# Altium schematic sheet KS-WL-GW-ETH.SchDoc
size A4; CheckedBy: Fan mingjie; DrawnBy: Jason Huang; Address1: Buliding 5, No.1528; Address2: Gu Mei Rd HQ6; Address3: Shanghai, China; Address4: 20233; DocumentNumber: 1; Revision: 1; SheetNumber: 1; SheetTotal: 2
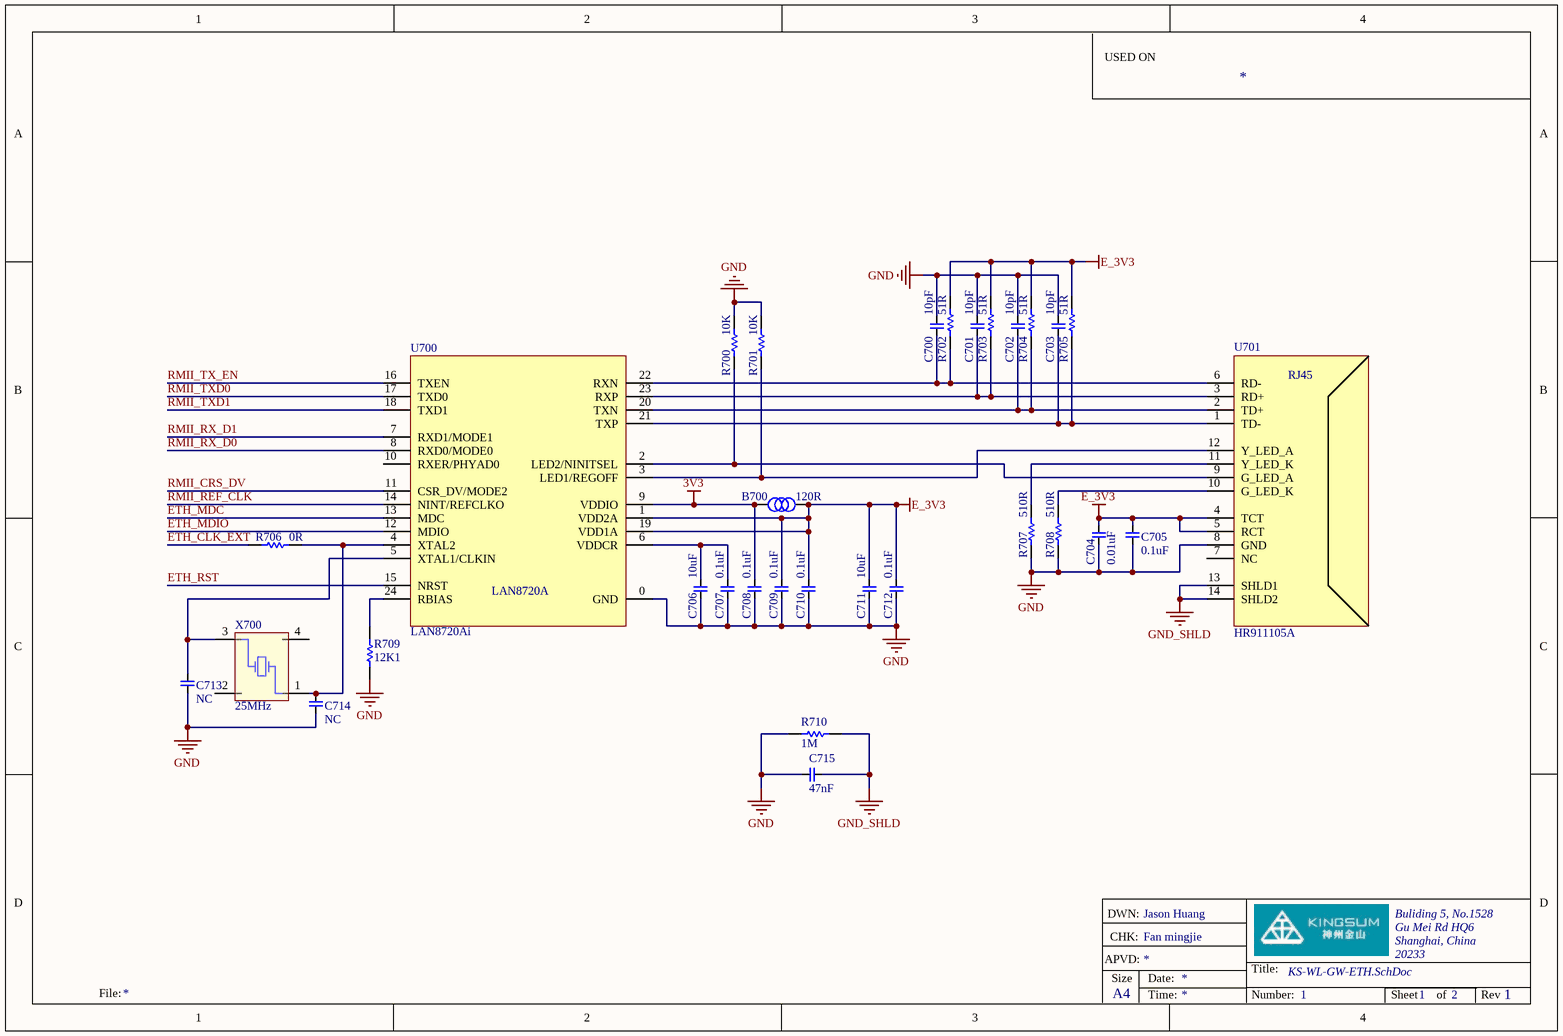
[diagram p0: KS-WL-GW-ETH.SchDoc]

## Parts
B700  120R  [0603 RES]
C700  10pF  [0402 CAP]
C701  10pF  [0402 CAP]
C702  10pF  [0402 CAP]
C703  10pF  [0402 CAP]
C704  0.01uF  [0402 CAP]
C705  0.1uF  [0402 CAP]
C706  10uF  [C0805]
C707  0.1uF  [0402 CAP]
C708  0.1uF  [0402 CAP]
C709  0.1uF  [0402 CAP]
C710  0.1uF  [0402 CAP]
C711  10uF  [C0805]
C712  0.1uF  [0402 CAP]
C713  NC  [0402 CAP]
C714  NC  [0402 CAP]
C715  47nF  [C1206]
R700  10K  [0402 Res]
R701  10K  [0402 Res]
R702  51R  [0402 Res]
R703  51R  [0402 Res]
R704  51R  [0402 Res]
R705  51R  [0402 Res]
R706  0R  [0402 Res]
R707  510R  [0402 Res]
R708  510R  [0402 Res]
R709  12K1  [0402 Res]
R710  1M  [0402 Res]
U700  LAN8720Ai  [QFN24 4X4 0.5]
U701  HR911105A  [RJ45 Socket]
X700  25MHz  [XTAL_4 - 25X20]

## Nets
3V3: B700.1 C708.2 U700.9(VDDIO)
E_3V3: B700.2 C704.2 C705.2 C709.2 C710.2 C711.2 C712.2 R702.2 R703.2 R704.2 R705.2 U700.1(VDD2A) U700.19(VDD1A) U701.4(TCT) U701.5(RCT)
GND: C700.2 C701.2 C702.2 C703.2 C704.1 C705.1 C706.1 C707.1 C708.1 C709.1 C710.1 C711.1 C712.1 C713.1 C714.1 C715.1 R700.2 R701.2 R707.1 R708.1 R709.1 R710.2 U700.0(GND) U701.8(GND)
GND_SHLD: C715.2 R710.1 U701.13(SHLD1) U701.14(SHLD2)
ETH_CLK_EXT: R706.1
ETH_MDC: U700.13(MDC)
ETH_MDIO: U700.12(MDIO)
ETH_RST: U700.15(NRST)
RMII_CRS_DV: U700.11(CSR_DV/MODE2)
RMII_REF_CLK: U700.14(NINT/REFCLKO)
RMII_RX_D0: U700.8(RXD0/MODE0)
RMII_RX_D1: U700.7(RXD1/MODE1)
RMII_TX_EN: U700.16(TXEN)
RMII_TXD0: U700.17(TXD0)
RMII_TXD1: U700.18(TXD1)
NetC700_1: C700.1 R702.1 U700.22(RXN) U701.6(RD-)
NetC701_1: C701.1 R703.1 U700.23(RXP) U701.3(RD+)
NetC702_1: C702.1 R704.1 U700.20(TXN) U701.2(TD+)
NetC703_1: C703.1 R705.1 U700.21(TXP) U701.1(TD-)
NetC706_2: C706.2 C707.2 U700.6(VDDCR)
NetC713_2: C713.2 U700.5(XTAL1/CLKIN) X700.3(OSC3)
NetC714_2: C714.2 R706.2 U700.4(XTAL2) X700.1(OSC1)
NetR700_1: R700.1 U700.2(LED2/NINITSEL) U701.9(G_LED_A)
NetR701_1: R701.1 U700.3(LED1/REGOFF) U701.12(Y_LED_A)
NetR707_2: R707.2 U701.11(Y_LED_K)
NetR708_2: R708.2 U701.10(G_LED_K)
NetR709_2: R709.2 U700.24(RBIAS)

Not connected (* = marked no-connect by the designer): U700 10(RXER/PHYAD0); U701 7(NC); X700 2(OSC2) 4(OSC4)

## Notes on the sheet
- USED ON
- DWN:
- APVD:
- CHK:
- Size
- Date:
- Title:
- File:
- A4
- Time:
- Number:
- Sheet
- of
- Rev
- (in symbol Kingsum-LAN-LAN8720Ai) LAN8720A
- (in symbol Kingsum-Socket-RJ45) RJ45

## Library data of the parts
B700 = ADE-Bead-BLM18PG121SN1D: Bead, Power, 1000mA, CHIP, SURFACE MOUNT , 120R; Part Rev: J; Part Description: Bead, Power, 1000mA, CHIP, SURFACE MOUNT,120R, 0.05R; Manufacturer: MURATA; Precision: +/-20%; DC Resistance (DCR): 0.05R; Shielding: NO; Current Rating: 2000mA; Option: 0; TE PN: ADE-Bead-BLM18PG121SN1D; Series: Bead; RoHS Compliant: NO; Value: 120R; Package: 0603; Footprint: 0603; SPICE model: Bead; Signal Integrity: Bead; Published: 10/14/2016; Publisher: TE Connectivity; LatestRevisionDate: 1/11/2012; LatestRevisionNote: PRODUCTION; ComponentLink1Description: Datasheet; ComponentLink1URL: http://cn.element14.com/jsp/search/productdetail.jsp?sku=1515745&CMP=KNC-BAI-SEPO-SKU-MUR&mckv=1af2yi9PU|pcrid|1462500496; ComponentLink2Description: Web Page; ComponentLink2URL: http://cn.element14.com/jsp/search/productdetail.jsp?sku=1515745&CMP=KNC-BAI-SEPO-SKU-MUR&mckv=1af2yi9PU|pcrid|1462500496; Mfr_PN: BLM18PG121SN1D; ComponentLink3Description: Package; ComponentLink3URL: http://cn.element14.com/jsp/search/productdetail.jsp?sku=1515745&CMP=KNC-BAI-SEPO-SKU-MUR&mckv=1af2yi9PU|pcrid|1462500496; Price: *
C700-C703 = ADE-C0402-10P: Non-polarised capacitor; Part Rev: V; Part Description: CAPACITOR, CERAMIC CHIP, 0402 CASE, SURFACE MOUNT , 10 pF +/-5% 50 V, C0G; Mfr_PN: GRM1555C1H100JA01; Manufacturer: MURATA; Tolerance: +/-5%; Volt-Rated: 50 V; Signal Integrity: Cap; Option: 0; TE PN: ADE-C0402-10P; Series: MLCC; RoHS Compliant: YES; Value: 10pF; Package: 0402; Footprint: 0402; SPICE model: CAP; Published: 10/14/2016; Publisher: TE Connectivity; LatestRevisionDate: 04/22/2013; LatestRevisionNote: Production; ComponentLink1Description: Datasheet; ComponentLink1URL: http://engineeringportal.tycoelectronics.com/web/engineering/part-inquiry?PartNo=1-20065-7; ComponentLink3Description: Package; ComponentLink3URL: http://www.murata.com/products/catalog/pdf/c02e.pdf; ComponentLink2Description: Web Page; ComponentLink2URL: http://dmtec.tycoelectronics.com/dmtec/servlet/DocumentLookup?type=Production+Drawing&name=20065&format=PDF; Price: *; Stock: *; Stock Position: *
C704 = ADE-C0402-0.01U: Non-polarised capacitor; Part Rev: V; Part Description: CAPACITOR, CERAMIC CHIP, 0402 CASE, SURFACE MOUNT , 0.01 uF +/-10% 50 V, X7R; Mfr_PN: GRM155R71H103KA88; Manufacturer: MURATA; Tolerance: +/-10%; Volt-Rated: 50 V; Signal Integrity: Cap; Option: 0; TE PN: ADE-C0402-0.01U; Series: MLCC; RoHS Compliant: YES; Value: 0.01uF; Package: 0402; Footprint: 0402; SPICE model: CAP; Published: 10/14/2016; Publisher: TE Connectivity; LatestRevisionDate: 04/22/2013; LatestRevisionNote: Production; ComponentLink1Description: Datasheet; ComponentLink1URL: http://engineeringportal.tycoelectronics.com/web/engineering/part-inquiry?PartNo=1-20065-7; ComponentLink3Description: Package; ComponentLink3URL: http://www.murata.com/products/catalog/pdf/c02e.pdf; ComponentLink2Description: Web Page; ComponentLink2URL: http://dmtec.tycoelectronics.com/dmtec/servlet/DocumentLookup?type=Production+Drawing&name=20065&format=PDF
C705 C707-C710 C712 = ADE-C0402-0.1U: Non-polarised capacitor; Part Rev: V; Part Description: CAPACITOR, CERAMIC CHIP, 0402 CASE, SURFACE MOUNT , 0.1 uF +/-20% 25 V, X7R; Mfr_PN: GRM155R61E104KA87; Manufacturer: MURATA; Tolerance: +/-10%; Volt-Rated: 25 V; Signal Integrity: Cap; Option: 0; TE PN: ADE-C0402-0.1U; Series: MLCC; RoHS Compliant: YES; Value: 0.1uF; Package: 0402; Footprint: 0402; SPICE model: CAP; Published: 10/14/2016; Publisher: TE Connectivity; LatestRevisionDate: 04/22/2013; LatestRevisionNote: Production; ComponentLink1Description: Datasheet; ComponentLink1URL: http://engineeringportal.tycoelectronics.com/web/engineering/part-inquiry?PartNo=1-20065-7; ComponentLink3Description: Package; ComponentLink3URL: http://www.murata.com/products/catalog/pdf/c02e.pdf; ComponentLink2Description: Web Page; ComponentLink2URL: http://dmtec.tycoelectronics.com/dmtec/servlet/DocumentLookup?type=Production+Drawing&name=20065&format=PDF; Manufacturer2: Yageo; Mfr_PN2: CC0402KRX7R8BB104
C706 C711 = ADE-C0805-10U: Non-polarised capacitor; Part Rev: V; Part Description: CAPACITOR, CERAMIC CHIP, 0805 CASE, SURFACE MOUNT , 10 uF +/-10% 25 V, X5R; Mfr_PN: GRM219R61E475KA73; Manufacturer: MURATA; Tolerance: +/-10%; Volt-Rated: 25 V; Signal Integrity: Cap; Option: 0; TE PN: ADE-C0805-10U; Series: MLCC; RoHS Compliant: YES; Value: 10uF; Package: C0805; SPICE model: CAP; Published: 10/17/2016; Publisher: TE Connectivity; LatestRevisionDate: 04/22/2013; LatestRevisionNote: Production; ComponentLink1Description: Datasheet; ComponentLink1URL: http://engineeringportal.tycoelectronics.com/web/engineering/part-inquiry?PartNo=1-20065-7; ComponentLink3Description: Package; ComponentLink3URL: http://www.murata.com/products/catalog/pdf/c02e.pdf; ComponentLink2Description: Web Page; ComponentLink2URL: http://dmtec.tycoelectronics.com/dmtec/servlet/DocumentLookup?type=Production+Drawing&name=20065&format=PDF; Price: *; Stock: *; Stock Position: *
C713 C714 = ADE-C0402-NC: Non-polarised capacitor; Part Rev: V; Part Description: CAPACITOR, CERAMIC CHIP, 0402 CASE, SURFACE MOUNT ,NC; Manufacturer: MURATA; Signal Integrity: Cap; Option: 0; TE PN: ADE-C0402-NC; Series: MLCC; RoHS Compliant: YES; Value: NC; Tolerance: -; Package: 0402; Volt-Rated: -; Footprint: 0402; SPICE model: CAP; Published: 10/14/2016; Publisher: TE Connectivity; LatestRevisionDate: 11/29/2012; LatestRevisionNote: Production; ComponentLink1Description: Datasheet; ComponentLink1URL: http://engineeringportal.tycoelectronics.com/web/engineering/part-inquiry?PartNo=1-20065-7; Mfr_PN: NC; ComponentLink3Description: Package; ComponentLink3URL: http://www.murata.com/products/catalog/pdf/c02e.pdf; ComponentLink2Description: Web Page; ComponentLink2URL: http://dmtec.tycoelectronics.com/dmtec/servlet/DocumentLookup?type=Production+Drawing&name=20065&format=PDF
C715 = ADE-C1206-47nF: Non-polarised capacitor; Part Rev: V; Part Description: CAPACITOR, CERAMIC CHIP, 1206 CASE, SURFACE MOUNT , 47 nF +/-5% 50 V, C0G; Mfr_PN: GRM31M5C1H473JA01#; Manufacturer: MURATA; TE PN: ADE-C1206-47U; Tolerance: +/-5%; Volt-Rated: 50V; Signal Integrity: Cap; Option: 0; Series: MLCC; RoHS Compliant: YES; Value: 47nF; Package: C1206; SPICE model: CAP; Published: 10/17/2016; Publisher: TE Connectivity; LatestRevisionDate: 23/01/2015; LatestRevisionNote: Production; ComponentLink1Description: Datasheet; ComponentLink1URL: http://engineeringportal.tycoelectronics.com/web/engineering/part-inquiry?PartNo=1-20065-7; ComponentLink3Description: Package; ComponentLink3URL: http://www.murata.com/products/catalog/pdf/c02e.pdf; ComponentLink2Description: Web Page; ComponentLink2URL: http://dmtec.tycoelectronics.com/dmtec/servlet/DocumentLookup?type=Production+Drawing&name=20065&format=PDF
R700 R701 = ADE-R0402-10K: RESISTOR  Normal; Part Rev: A; Part Description: RESISTOR, CHIP, THICK FILM, SURGE CURRENT, 0402 CASE, 1/16 W, 50 V , 10K OHMS +/-5%, +/-100 PPM/DEG C, TIN TERMINATION; Mfr_PN: RC0402JR-7D10KL; Manufacturer: YAGEO; Precision: +/-5%; Volt-Rated: 50 V; Power-Rated: 1/16 W; Signal Integrity: Res; Option: 0; TE_PN: ADE-R0402-10K; ComponentLink2Description: Web Page; ComponentLink2URL: http://dmtec.tycoelectronics.com/dmtec/servlet/DocumentLookup?type=Production+Drawing&name=1900457&format=PDF; Series: General Purpose Chip Resistors; ComponentLink3URL: http://www.yageo.com/documents/recent/PYu-RC0402_51_RoHS_L_6_r.pdf; RoHS Compliant: YES; Value: 10K; Package: 0402; Footprint: kOA1E-0402; SPICE model: RESISTOR; Published: 25/04/2013; Publisher: TE Connectivity; LatestRevisionDate: 25/04/2013; LatestRevisionNote: Production; ComponentLink1URL: http://engineeringportal.tycoelectronics.com/web/engineering/part-inquiry?PartNo=1900457-1; ComponentLink1Description: Datasheet; ComponentLink3Description: Package
R702-R705 = ADE-R0402-51R: RESISTOR  Normal; Part Rev: A; Part Description: RESISTOR, CHIP, THICK FILM, SURGE CURRENT, 0402 CASE, 1/16 W, 50 V , 51 OHMS +/-5%, +/-100 PPM/DEG C, TIN TERMINATION; Mfr_PN: RC0402JR-7D51RL; Manufacturer: YAGEO; Precision: +/-5%; Volt-Rated: 50 V; Power-Rated: 1/16 W; Signal Integrity: Res; Option: 0; TE_PN: ADE-R0402-51R; ComponentLink2Description: Web Page; ComponentLink2URL: http://dmtec.tycoelectronics.com/dmtec/servlet/DocumentLookup?type=Production+Drawing&name=1900457&format=PDF; Series: General Purpose Chip Resistors; ComponentLink3URL: http://www.yageo.com/documents/recent/PYu-RC0402_51_RoHS_L_6_r.pdf; RoHS Compliant: YES; Value: 51R; Package: 0402; Footprint: kOA1E-0402; SPICE model: RESISTOR; Published: 25/04/2013; Publisher: TE Connectivity; LatestRevisionDate: 04/25/2013; LatestRevisionNote: Production; ComponentLink1URL: http://engineeringportal.tycoelectronics.com/web/engineering/part-inquiry?PartNo=1900457-1; ComponentLink1Description: Datasheet; ComponentLink3Description: Package
R706 = ADE-R0402-0R: RESISTOR  Normal; Part Rev: A; Part Description: RESISTOR, CHIP, THICK FILM, SURGE CURRENT, 0402 CASE, 1/16 W, 50V, 1 A , 0 OHMS +/-5%, +/-200 PPM/DEG C, TIN TERMINATION; Mfr_PN: RC0402JR-7D0RL; Manufacturer: YAGEO; Precision: +/-5%; Volt-Rated: 50 V; Power-Rated: 1/16 W; Signal Integrity: Res; Option: 0; TE_PN: ADE-R0402-0R; ComponentLink2Description: Web Page; ComponentLink2URL: http://dmtec.tycoelectronics.com/dmtec/servlet/DocumentLookup?type=Production+Drawing&name=1900457&format=PDF; Series: General Purpose Chip Resistors; ComponentLink3URL: http://www.yageo.com/documents/recent/PYu-RC0402_51_RoHS_L_6_r.pdf; RoHS Compliant: YES; Value: 0R; Package: 0402; Footprint: kOA1E-0402; SPICE model: RESISTOR; Published: 25/04/2013; Publisher: TE Connectivity; LatestRevisionDate: 11/15/2012; LatestRevisionNote: Production; ComponentLink1URL: http://engineeringportal.tycoelectronics.com/web/engineering/part-inquiry?PartNo=1900457-1; ComponentLink1Description: Datasheet; ComponentLink3Description: Package
R707 R708 = ADE-R0402-510R: RES, Carbon Film SMT0402, 510 Ohm, 5%, 1/16W; Part Rev: A; Mfr_PN: RC0402JR-7D510RL; Manufacturer: YAGEO; Precision: +/-5%; Volt-Rated: 50 V; Option: 0; TE_PN: ADE-R0402-510R; ComponentLink2Description: Web Page; ComponentLink2URL: http://dmtec.tycoelectronics.com/dmtec/servlet/DocumentLookup?type=Production+Drawing&name=1900457&format=PDF; Series: General Purpose Chip Resistors; Part Description: RES, Carbon Film SMT0402, 510 Ohm, 5%, 1/16W; ComponentLink3URL: http://www.yageo.com/documents/recent/PYu-RC0402_51_RoHS_L_6_r.pdf; RoHS Compliant: YES; Value: 510R; Package: 0402; Power-Rated: 1/16 W; Footprint: 0402; SPICE model: RESISTOR; Signal Integrity: Res; Published: 25/04/2013; Publisher: TE Connectivity; LatestRevisionDate: 25/04/2013; LatestRevisionNote: Production; ComponentLink1URL: http://engineeringportal.tycoelectronics.com/web/engineering/part-inquiry?PartNo=1900457-1; ComponentLink1Description: Datasheet; ComponentLink3Description: Package
R709 = ADE-R0402-12K1-1%: RESISTOR  Normal; Part Rev: A; Part Description: RESISTOR, CHIP, THICK FILM, SURGE CURRENT, 0402 CASE, 1/16 W, 50 V , 12K OHMS +/-1%, +/-100 PPM/DEG C, TIN TERMINATION; Mfr_PN: RC0402FR-0712K1L; Manufacturer: YAGEO; Precision: +/-1%; Volt-Rated: 50 V; Power-Rated: 1/16 W; Signal Integrity: Res; Option: 0; ComponentLink2Description: Web Page; ComponentLink2URL: http://dmtec.tycoelectronics.com/dmtec/servlet/DocumentLookup?type=Production+Drawing&name=1900457&format=PDF; Series: General Purpose Chip Resistors; ComponentLink3URL: http://www.yageo.com/documents/recent/PYu-RC0402_51_RoHS_L_6_r.pdf; RoHS Compliant: YES; Value: 12K1; Package: 0402; SPICE model: RESISTOR; Published: 27/03/2014; Publisher: TE Connectivity; LatestRevisionDate: 25/04/2013; LatestRevisionNote: Production; ComponentLink1URL: http://engineeringportal.tycoelectronics.com/web/engineering/part-inquiry?PartNo=1900457-1; ComponentLink1Description: Datasheet; ComponentLink3Description: Package
R710 = ADE-R0402-1M: RESISTOR  Normal; Part Rev: A; Part Description: RESISTOR, CHIP, THICK FILM, SURGE CURRENT, 0402 CASE, 1/16 W, 50 V , 20K OHMS +/-5%, +/-100 PPM/DEG C, TIN TERMINATION; Mfr_PN: RC0402JR-7D1ML; Manufacturer: YAGEO; Precision: +/-5%; Volt-Rated: 50 V; Power-Rated: 1/16 W; Signal Integrity: Res; Option: 0; TE_PN: ADE-R0402-1M; ComponentLink2Description: Web Page; ComponentLink2URL: http://dmtec.tycoelectronics.com/dmtec/servlet/DocumentLookup?type=Production+Drawing&name=1900457&format=PDF; Series: General Purpose Chip Resistors; ComponentLink3URL: http://www.yageo.com/documents/recent/PYu-RC0402_51_RoHS_L_6_r.pdf; RoHS Compliant: YES; Value: 1M; Package: 0402; Footprint: kOA1E-0402; SPICE model: RESISTOR; Published: 25/04/2013; Publisher: TE Connectivity; LatestRevisionDate: 25/04/2013; LatestRevisionNote: Production; ComponentLink1URL: http://engineeringportal.tycoelectronics.com/web/engineering/part-inquiry?PartNo=1900457-1; ComponentLink1Description: Datasheet; ComponentLink3Description: Package
U700 = Kingsum-LAN-LAN8720Ai: Small Footprint RMII 10/100  Ethernet Transceiver with HP  Auto-MDIX Support; Manufacturer: SMSC; Option: 0; Tmp Range: -40 to 85; Publisher: FMJ; ComponentLink1Description: Datasheet; ComponentLink1URL: Datasheet/LAN; ComponentLink2Description: Web Page; ComponentLink3Description: Procurement; ComponentLink3URL: http://www.szlcsc.com/product/details_17831.html; Code_IPC: *; Code_JEITA: *; Footprint: QFN24; LatestRevisionNote: PRODUCTION; Mfr_PN: LAN8720Ai; Package: QFN24; Part Rev: *; Published: 10/14/2016; RoHS Compliant: YES; Kingsum PN: Kingsum-LAN-LAN8720Ai; Part Description: Small Footprint RMII 10/100  Ethernet Transceiver with HP  Auto-MDIX Support; Price: *; Stock: *; Stock Position: *
U701 = Kingsum-Socket-RJ45: RJ45 SOCKET; Manufacturer: HANRUN; Option: 0; Tmp Range: 0 to 70; Publisher: FMJ; ComponentLink1Description: Datasheet; ComponentLink1URL: Datasheet/SOCKET; ComponentLink2Description: Web Page; ComponentLink3Description: Procurement; ComponentLink3URL: http://www.szlcsc.com/product/details_12651.html; Code_IPC: *; Code_JEITA: *; Footprint: HR911105A; LatestRevisionNote: PRODUCTION; Mfr_PN: HR911105A; Package: HR911105A; Part Rev: *; Published: 10/14/2016; RoHS Compliant: YES; Kingsum PN: Kingsum-Socket-RJ45; Part Description: RJ45 SOCKET; Price: 1; Stock: *; Stock Position: *
X700 = Kingsum-XTAL-XXCCCLNANF-25M: XTAL, 25M 10pF 100ppm; Part Description: Cystal Oscillator, NX2520SA , 32MHZ, SMD, 15pF; Manufacturer: TACT; Tolerance: ±20ppm; Option: 0; Tmp Range: -40 to 85; Kingsum PN: Kingsum-XTAL-XXCCCLNANF-25M; RoHS Compliant: YES; Value: 25MHz; Package: 2520; Footprint: XTAL_4; SPICE model: XTAL; Signal Integrity: XTAL; Published: 05/02/2015; LatestRevisionDate: 05/02/2015; LatestRevisionNote: Production; ComponentLink1URL: http://www.ndk.com/images/products/catalog/c_NX2520SA_e.pdf; Mfr_PN: XXCCCLNANF-25M; ComponentLink3Description: Procurement; ComponentLink3URL: http://www.szlcsc.com/product/details_119135.html; ComponentLink2Description: Web Page